# EAGLE design latch_circuit_RTC (EAGLE 9.6.2)
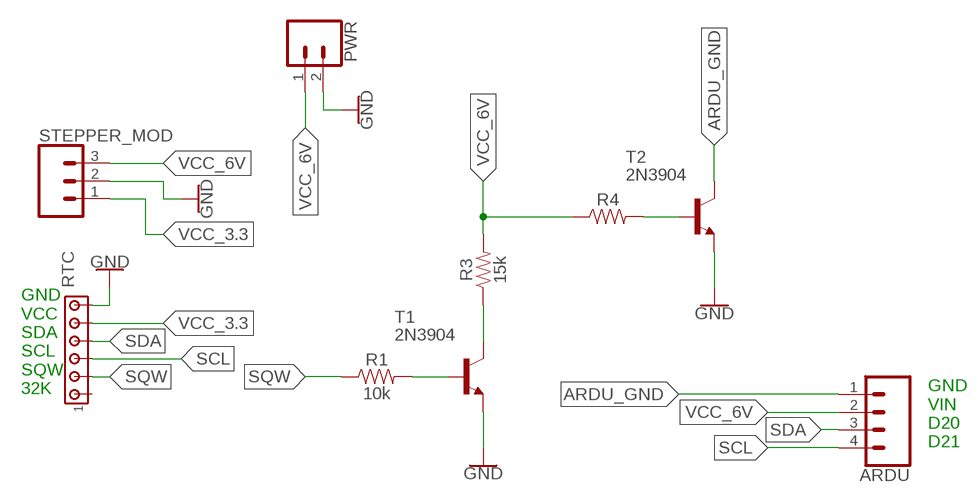
[diagram p0: schematic, sheet 1]

## Parts
ARDU  CONN_04PTH  [1X04]
PWR  CONN_02  [1X02]
R1  10k  10KOHM-HORIZ-1/4W-1%  [AXIAL-0.3]
R3  15k  15KOHM-HORIZ-1/4W-5%  [AXIAL-0.3]
R4  RESISTORAXIAL-0.3  [AXIAL-0.3]
RTC  MTA06-100  [10X06MTA]
STEPPER_MOD  CONN_03  [1X03]
T1  2N3904  [TO92]
T2  2N3904  [TO92]

## Nets
ARDU_GND [New Class]: ARDU.1 T2.1(C)
GND [New Class]: PWR.2 RTC.6 STEPPER_MOD.2 T1.3(E) T2.3(E)
N$1 [New Class]: R1.P$2 T1.2(B)
N$2 [New Class]: R4.P$2 T2.2(B)
N$3 [New Class]: R3.P$1 T1.1(C)
SCL [New Class]: ARDU.4 RTC.3
SDA [New Class]: ARDU.3 RTC.4
SQW [New Class]: R1.P$1 RTC.2
VCC_3.3 [New Class]: RTC.5 STEPPER_MOD.1
VCC_6V [New Class]: ARDU.2 PWR.1 R3.P$2 R4.P$1 STEPPER_MOD.3
Unconnected: RTC.1

## Notes on the sheet
- GND
  VCC
  SDA
  SCL
  SQW
  32K
- GND
  VIN
  D20
  D21

## Library data of the parts
ARDU = SparkFun-Connectors:CONN_04: Multi connection point. Often used as Generic Header-pin footprint for 0.1 inch spaced/style header connections On any of the 0.1 inch spaced packages, you can populate with these: Break Away Headers - Straight <https://www.sparkfun.com/products/116> (PRT-00116) Break Away Male Headers - Right Angle <https://www.sparkfun.com/products/553> (PRT-00553) Female Headers <https://www.sparkfun.com/products/115> (PRT-00115) Break Away Headers - Machine Pin <https://www.sparkfun.com/products/117> (PRT-00117) Break Away Female Headers - Swiss Machine Pin <https://www.sparkfun.com/products/743> (PRT-00743) For SCREWTERMINALS and SPRING TERMINALS visit here: Screw Terimnals on SparkFun.com <https://www.sparkfun.com/search/results?term=Screw+Terminals> (5mm/3.5mm/2.54mm spacing) This device is also useful as a general connection point to wire up your design to another part of your project. Our various solder wires solder well into these plated through hole pads. Hook-Up Wire - Assortment (Stranded, 22 AWG) <https://www.sparkfun.com/products/11375> (PRT-11375) Hook-Up Wire - Assortment (Solid Core, 22 AWG) <https://www.sparkfun.com/products/11367> (PRT-11367) View the entire wire category on our website here <https://www.sparkfun.com/categories/141> Special notes: Molex polarized connector foot print use with SKU : PRT-08231 with associated crimp pins and housings. 1MM SMD Version SKU: PRT-10208; PROD_ID: CONN-09696
PWR = SparkFun-Connectors:CONN_02: Multi connection point. Often used as Generic Header-pin footprint for 0.1 inch spaced/style header connections On any of the 0.1 inch spaced packages, you can populate with these: Break Away Headers - Straight <https://www.sparkfun.com/products/116> (PRT-00116) Break Away Male Headers - Right Angle <https://www.sparkfun.com/products/553> (PRT-00553) Female Headers <https://www.sparkfun.com/products/115> (PRT-00115) Break Away Headers - Machine Pin <https://www.sparkfun.com/products/117> (PRT-00117) Break Away Female Headers - Swiss Machine Pin <https://www.sparkfun.com/products/743> (PRT-00743) For SCREWTERMINALS and SPRING TERMINALS visit here: Screw Terimnals on SparkFun.com <https://www.sparkfun.com/search/results?term=Screw+Terminals> (5mm/3.5mm/2.54mm spacing) This device is also useful as a general connection point to wire up your design to another part of your project. Our various solder wires solder well into these plated through hole pads. Hook-Up Wire - Assortment (Stranded, 22 AWG) <https://www.sparkfun.com/products/11375> (PRT-11375) Hook-Up Wire - Assortment (Solid Core, 22 AWG) <https://www.sparkfun.com/products/11367> (PRT-11367) View the entire wire category on our website here <https://www.sparkfun.com/categories/141> Special notes: Molex polarized connector foot print use with: PRT-08233 with associated crimp pins and housings. 2.54_SCREWTERM for use with PRT-10571. 3.5mm Screw Terminal footprints for PRT-08084 5mm Screw Terminal footprints for use with PRT-08432
R1 = SparkFun-Resistors:10KOHM: 10kΩ resistor A resistor is a passive two-terminal electrical component that implements electrical resistance as a circuit element. Resistors act to reduce current flow, and, at the same time, act to lower voltage levels within circuits. - Wikipedia; PROD_ID: RES-12183
R3 = SparkFun-Resistors:15KOHM: 15kΩ resistor A resistor is a passive two-terminal electrical component that implements electrical resistance as a circuit element. Resistors act to reduce current flow, and, at the same time, act to lower voltage levels within circuits. - Wikipedia; PROD_ID: RES-11360
R4 = SparkFun-Resistors:RESISTOR: Generic Resistor Package
RTC = con-amp:MTA06-100: AMP connector Connection corrected 2014-09-19
STEPPER_MOD = SparkFun-Connectors:CONN_03: Multi connection point. Often used as Generic Header-pin footprint for 0.1 inch spaced/style header connections On any of the 0.1 inch spaced packages, you can populate with these: Break Away Headers - Straight <https://www.sparkfun.com/products/116> (PRT-00116) Break Away Male Headers - Right Angle <https://www.sparkfun.com/products/553> (PRT-00553) Female Headers <https://www.sparkfun.com/products/115> (PRT-00115) Break Away Headers - Machine Pin <https://www.sparkfun.com/products/117> (PRT-00117) Break Away Female Headers - Swiss Machine Pin <https://www.sparkfun.com/products/743> (PRT-00743) Stackable Header - 3 Pin (Female, 0.1") <https://www.sparkfun.com/products/13875> (PRT-13875) For SCREWTERMINALS and SPRING TERMINALS visit here: Screw Terimnals on SparkFun.com <https://www.sparkfun.com/search/results?term=Screw+Terminals> (5mm/3.5mm/2.54mm spacing) This device is also useful as a general connection point to wire up your design to another part of your project. Our various solder wires solder well into these plated through hole pads. Hook-Up Wire - Assortment (Stranded, 22 AWG) <https://www.sparkfun.com/products/11375> (PRT-11375) Hook-Up Wire - Assortment (Solid Core, 22 AWG) <https://www.sparkfun.com/products/11367> (PRT-11367) View the entire wire category on our website here <https://www.sparkfun.com/categories/141> Special notes: Molex polarized connector foot print use with SKU : PRT-08232 with associated crimp pins and housings.; PROD_ID: XXX-00000; VALUE: 455-1750-1-ND
T1 T2 = transistor:2N3904: NPN TRANSISTOR

## Net classes
1 New Class: width 0.762 mm, clearance 0.508 mm

## Board
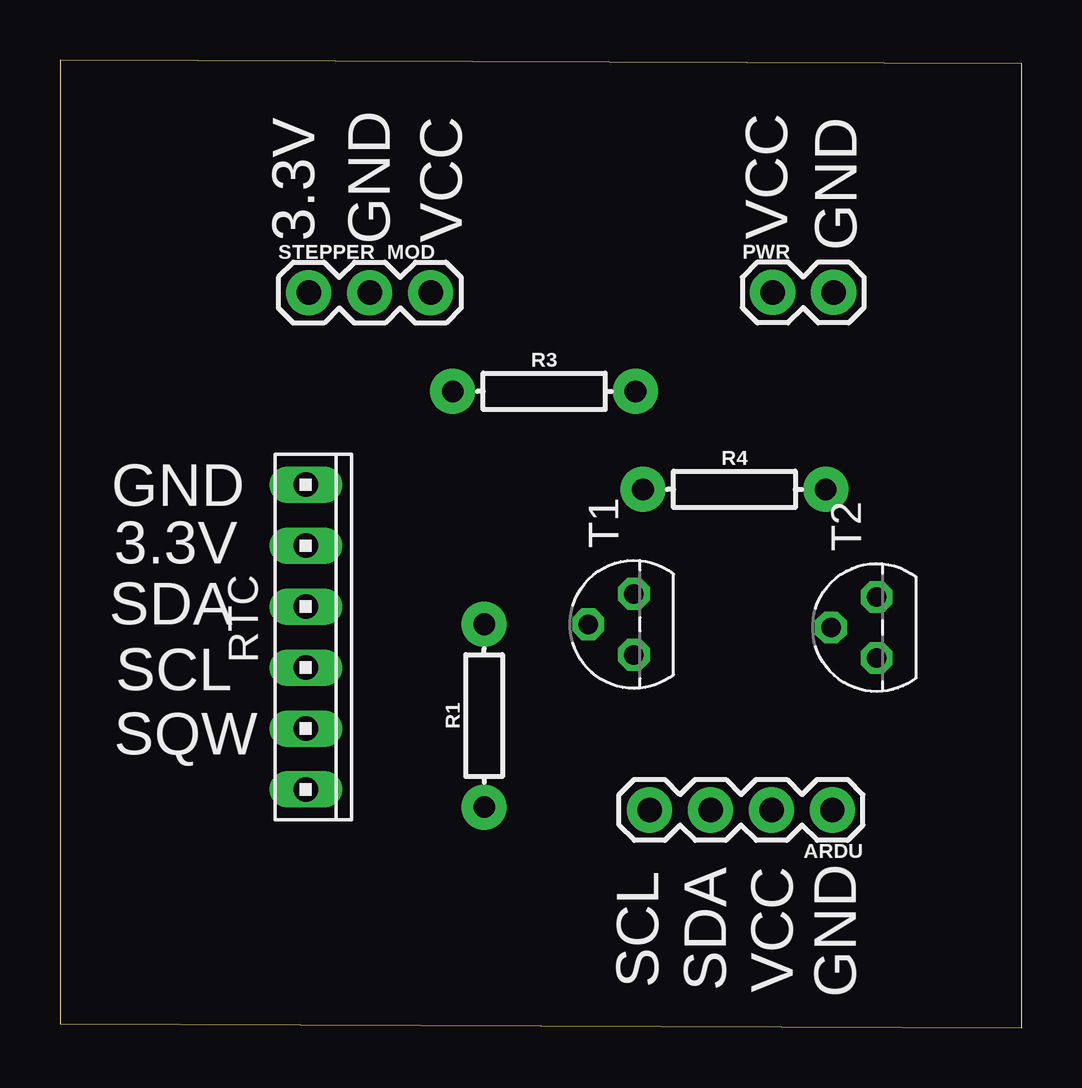
[diagram p1: board, top side]
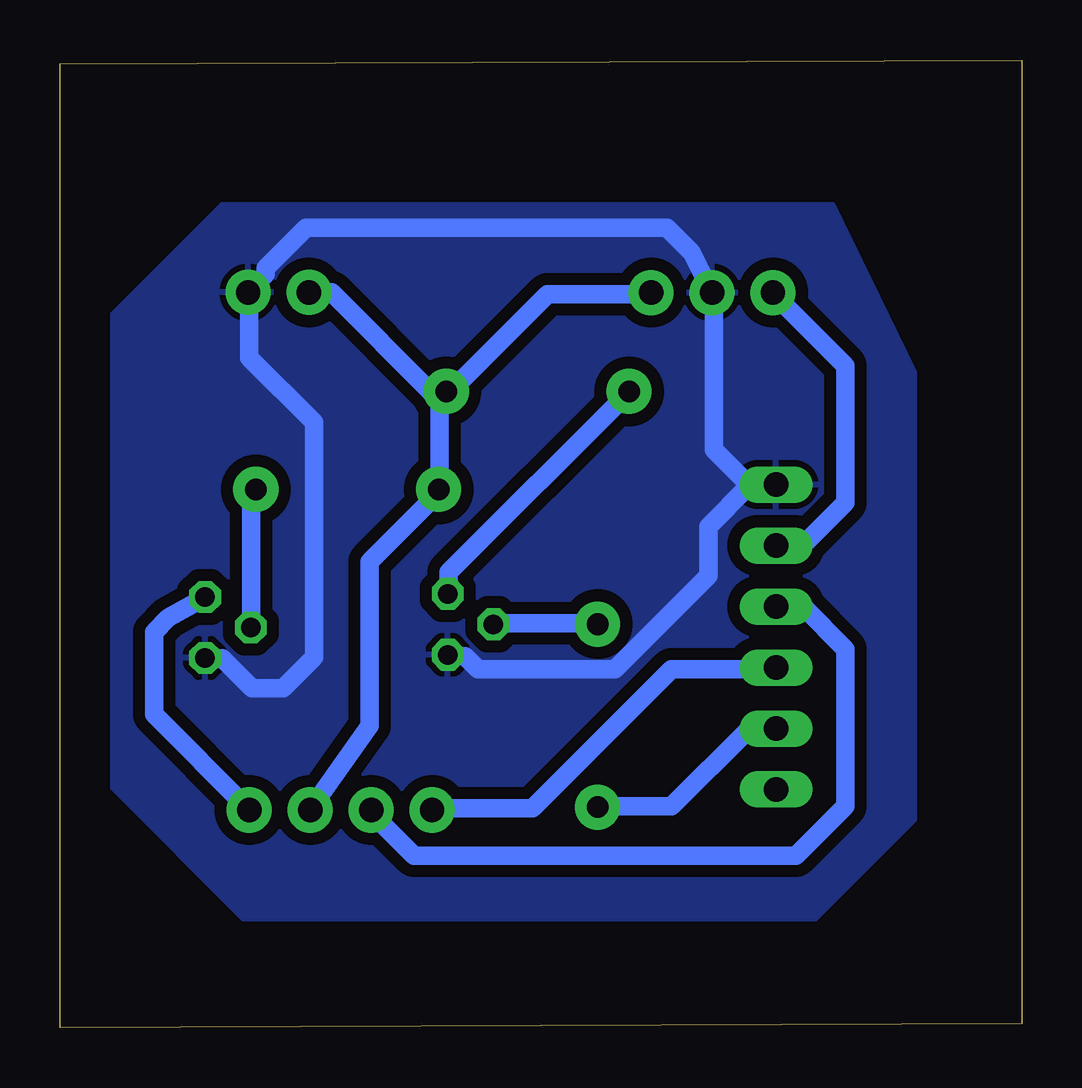
[diagram p2: board, bottom side, seen from below]

Size 40.09 x 40.33 mm. Coordinates in mm from the lower left corner, seen from the top.
Outline: 0,0.17 40.09,0 40.09,40.17 0,40.33 0,0.17
Copper layers (1*16): Top 0.035mm / dielectric 1.5mm / Bottom 0.035mm
Design rules "default *": minimum track width 6mil, minimum drill 0.35mm, track to track 6mil, track to pad 6mil, pad to pad 6mil, via to via 6mil, smd to smd 6mil, copper to edge 40mil, drill to drill 6mil, minimum pad ring 10mil, minimum via ring 8mil, stop-mask expansion 4mil, vias tented up to drill 0mil, thermal gap 10mil

### Footprints (pad centres in the part's own frame; a part is rotated, then mirrored left to right if it is on the bottom)
1X04 = drill 1.016 pad 1.88: 1 0,0; 2 2.54,0; 3 5.08,0; 4 7.62,0
1X02 = drill 1.016 pad 1.88: 1 0,0; 2 2.54,0
AXIAL-0.3 = drill 0.9 pad 1.88: P$1 -3.81,0; P$2 3.81,0
10X06MTA = drill 1.016 long: 1 6.35,0; 2 3.81,0; 3 1.27,0; 4 -1.27,0; 5 -3.81,0; 6 -6.35,0
1X03 = drill 1.016 pad 1.88: 1 0,0; 2 2.54,0; 3 5.08,0
TO92 = drill 0.813 octagon: 1 1.27,0; 2 0,1.905; 3 -1.27,0

### Placement (x,y rotation side)
ARDU  32.2,9.08 180 top
PWR  29.71,30.65 0 top
R1  17.68,13.01 90 top
R3  20.18,26.53 0 top
R4  28.11,22.44 0 top
RTC  10.24,16.29 270 top
STEPPER_MOD  10.37,30.64 0 top
T1  23.93,16.82 90 top
T2  34.04,16.69 90 top

### Tracks (layer width: path | path; a pad name or v marks a point on that pad's centre or on a via)
ARDU_GND
  Bottom 0.762: T2.1 35.58,17.09 36.17,16.49 36.17,13.06 32.27,9.16 ARDU.1
GND
  Bottom 0.762: T2.3 34.02,15.41 33.34,15.41 32.08,14.15 30.79,14.15 29.5,15.44 29.5,25.23 32.2,27.93 32.2,30.65 PWR.2 31.97,30.95 31.51,31.41 31.51,31.65 29.83,33.33 14.78,33.33 13.76,32.31 STEPPER_MOD.2 12.84,30.57 12.84,24.09 11.62,22.88 RTC.6 10.25,22.57 11.39,22.57 13.07,20.89 13.07,18.84 16.96,14.95 22.67,14.95 23.2,15.48 23.89,15.48 T1.3
  pour Bottom: 4.44,27.33 4.44,8.66 8.58,4.52 32.47,4.52 37.93,9.98 37.93,29.76 33.35,34.33 7.85,34.33
N$1
  Bottom 0.762: T1.2 21.99,16.86 17.72,16.86 R1.P$2
N$2
  Bottom 0.762: T2.2 32.12,16.7 32.12,22.27 31.97,22.42 R4.P$2
N$3
  Bottom 0.762: T1.1 23.89,18.15 23.89,18.99 16.42,26.46 R3.P$1
SCL
  Bottom 0.762: ARDU.4 24.58,9.16 20.39,9.16 14.59,14.95 10.25,14.95 RTC.3
SDA
  Bottom 0.762: ARDU.3 27.09,9.08 27.09,8.93 25.34,7.18 9.41,7.18 7.36,9.24 7.36,15.79 9.11,17.54 10.18,17.54 RTC.4
SQW
  Bottom 0.762: R1.P$1 17.64,9.24 14.59,9.24 11.39,12.44 10.25,12.44 RTC.2
VCC_3.3
  Bottom 0.762: RTC.5 10.18,20.13 9.11,20.13 7.36,21.88 7.36,27.6 10.33,30.57 STEPPER_MOD.1
VCC_6V
  Bottom 0.762: R3.P$2 24.04,26.46 24.27,26.23 24.27,22.49 R4.P$1 24.5,22.11 27.2,19.42 27.2,12.58 ARDU.2 | STEPPER_MOD.3 15.51,30.57 19.78,30.57 23.66,26.69 R3.P$2 | PWR.1 29.68,30.65 28.77,30.65 24.58,26.46 R3.P$2

### Text on the board
tPlace: 3.3V | VCC | VCC | GND | GND | GND | 3.3V | SDA | SCL | SQW | SDA | VCC | GND | SCL